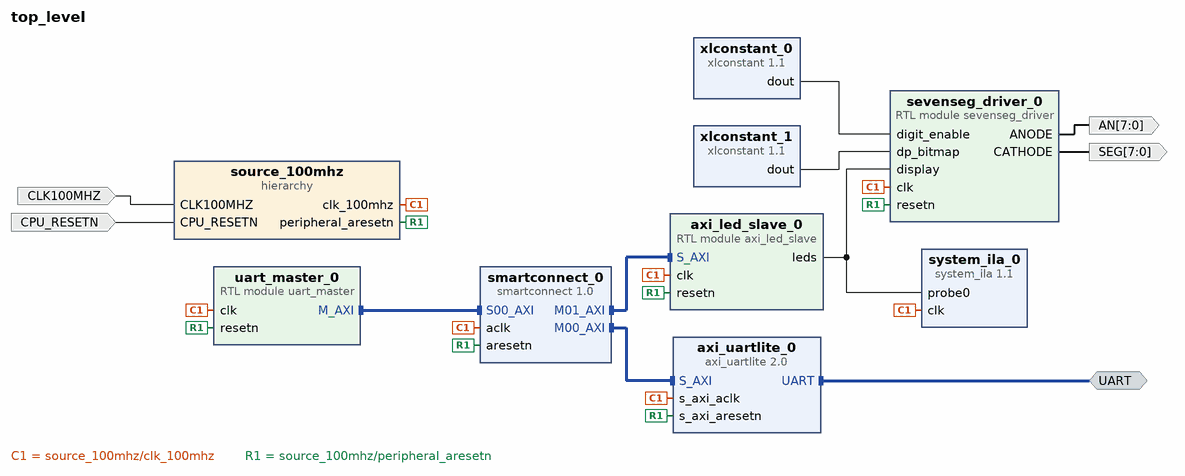
[diagram p0: block diagram of the top level]
# Vivado block design top_level, xc7a100tcsg324-1, Vivado 2021.1.1
create_bd_design top_level

create_bd_intf_port -mode Master -vlnv xilinx.com:interface:uart_rtl:1.0 UART
create_bd_port -dir I -type rst CPU_RESETN
create_bd_port -dir I -type clk CLK100MHZ
create_bd_port -dir O -from 7 -to 0 AN
create_bd_port -dir O -from 7 -to 0 SEG

create_bd_cell -type ip -vlnv xilinx.com:ip:smartconnect:1.0 smartconnect_0
set_property -dict {CONFIG.NUM_MI 2 CONFIG.NUM_SI 1} [get_bd_cells smartconnect_0]
create_bd_cell -type module -reference uart_master uart_master_0
create_bd_cell -type ip -vlnv xilinx.com:ip:axi_uartlite:2.0 axi_uartlite_0
set_property -dict {CONFIG.C_BAUDRATE 115200} [get_bd_cells axi_uartlite_0]
create_bd_cell -type hier source_100mhz
create_bd_cell -type module -reference sevenseg_driver sevenseg_driver_0
create_bd_cell -type ip -vlnv xilinx.com:ip:xlconstant:1.1 xlconstant_0
set_property -dict {CONFIG.CONST_VAL 0b11111111 CONFIG.CONST_WIDTH 8} [get_bd_cells xlconstant_0]
create_bd_cell -type ip -vlnv xilinx.com:ip:xlconstant:1.1 xlconstant_1
set_property -dict {CONFIG.CONST_VAL 0b00000000 CONFIG.CONST_WIDTH 8} [get_bd_cells xlconstant_1]
create_bd_cell -type ip -vlnv xilinx.com:ip:system_ila:1.1 system_ila_0
set_property -dict {CONFIG.C_MON_TYPE MIX} [get_bd_cells system_ila_0]
create_bd_cell -type module -reference axi_led_slave axi_led_slave_0

# ---- hierarchy /source_100mhz ----
current_bd_instance /source_100mhz
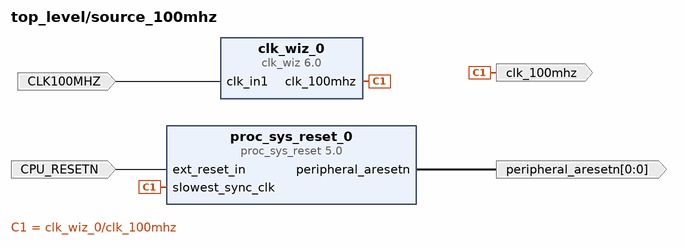
[diagram p1: block diagram inside /source_100mhz]
create_bd_pin -dir O -type clk clk_100mhz
create_bd_pin -dir I -type rst CPU_RESETN
create_bd_pin -dir O -from 0 -to 0 -type rst peripheral_aresetn
create_bd_pin -dir I -type clk CLK100MHZ

create_bd_cell -type ip -vlnv xilinx.com:ip:proc_sys_reset:5.0 proc_sys_reset_0
create_bd_cell -type ip -vlnv xilinx.com:ip:clk_wiz:6.0 clk_wiz_0
set_property -dict {CONFIG.CLK_OUT1_PORT clk_100mhz CONFIG.USE_LOCKED false CONFIG.USE_RESET false} [get_bd_cells clk_wiz_0]

# ---- connections ----

current_bd_instance /source_100mhz
connect_bd_net -net clk_in1_0_1 [get_bd_pins CLK100MHZ] [get_bd_pins clk_wiz_0/clk_in1]
connect_bd_net [get_bd_pins clk_wiz_0/clk_100mhz] [get_bd_pins clk_100mhz] [get_bd_pins proc_sys_reset_0/slowest_sync_clk]
connect_bd_net -net ext_reset_in_0_1 [get_bd_pins CPU_RESETN] [get_bd_pins proc_sys_reset_0/ext_reset_in]
connect_bd_net [get_bd_pins proc_sys_reset_0/peripheral_aresetn] [get_bd_pins peripheral_aresetn]

current_bd_instance /
connect_bd_intf_net [get_bd_intf_ports UART] [get_bd_intf_pins axi_uartlite_0/UART]
connect_bd_intf_net [get_bd_intf_pins axi_uartlite_0/S_AXI] [get_bd_intf_pins smartconnect_0/M00_AXI]
connect_bd_intf_net [get_bd_intf_pins axi_led_slave_0/S_AXI] [get_bd_intf_pins smartconnect_0/M01_AXI]
connect_bd_intf_net [get_bd_intf_pins uart_master_0/M_AXI] [get_bd_intf_pins smartconnect_0/S00_AXI]
connect_bd_net [get_bd_pins axi_led_slave_0/leds] [get_bd_pins sevenseg_driver_0/display] [get_bd_pins system_ila_0/probe0]
connect_bd_net -net clk_in1_0_1 [get_bd_ports CLK100MHZ] [get_bd_pins source_100mhz/CLK100MHZ]
connect_bd_net -net clk_wiz_0_clk_100mhz [get_bd_pins source_100mhz/clk_100mhz] \
  [get_bd_pins smartconnect_0/aclk] [get_bd_pins uart_master_0/clk] [get_bd_pins axi_uartlite_0/s_axi_aclk] \
  [get_bd_pins sevenseg_driver_0/clk] [get_bd_pins system_ila_0/clk] [get_bd_pins axi_led_slave_0/clk]
connect_bd_net -net ext_reset_in_0_1 [get_bd_ports CPU_RESETN] [get_bd_pins source_100mhz/CPU_RESETN]
connect_bd_net -net proc_sys_reset_0_peripheral_aresetn [get_bd_pins source_100mhz/peripheral_aresetn] \
  [get_bd_pins smartconnect_0/aresetn] [get_bd_pins uart_master_0/resetn] [get_bd_pins axi_uartlite_0/s_axi_aresetn] \
  [get_bd_pins sevenseg_driver_0/resetn] [get_bd_pins axi_led_slave_0/resetn]
connect_bd_net [get_bd_pins sevenseg_driver_0/ANODE] [get_bd_ports AN]
connect_bd_net [get_bd_pins sevenseg_driver_0/CATHODE] [get_bd_ports SEG]
connect_bd_net [get_bd_pins xlconstant_0/dout] [get_bd_pins sevenseg_driver_0/digit_enable]
connect_bd_net [get_bd_pins xlconstant_1/dout] [get_bd_pins sevenseg_driver_0/dp_bitmap]

# ---- address map ----
assign_bd_address -offset 0x40000000 -range 256 -target_address_space [get_bd_addr_spaces uart_master_0/M_AXI] [get_bd_addr_segs axi_led_slave_0/S_AXI/reg0]
assign_bd_address -offset 0x40600000 -range 256 -target_address_space [get_bd_addr_spaces uart_master_0/M_AXI] [get_bd_addr_segs axi_uartlite_0/S_AXI/Reg]

validate_bd_design
save_bd_design
